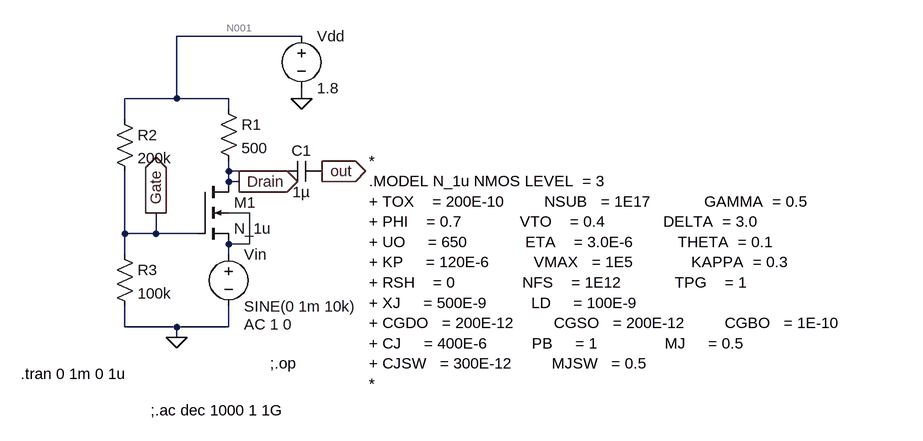
[diagram p0: schematic common gate exam.asc]
common gate exam.asc, the LTspice schematic file:
Version 4
SHEET 1 1292 680
WIRE 336 -128 144 -128
WIRE 144 -32 144 -128
WIRE 144 -32 64 -32
WIRE 224 -32 144 -32
WIRE 336 -32 336 -48
WIRE 224 -16 224 -32
WIRE 64 0 64 -32
WIRE 224 80 224 64
WIRE 304 80 224 80
WIRE 224 96 224 80
WIRE 240 96 224 96
WIRE 256 144 224 144
WIRE 64 176 64 80
WIRE 112 176 112 144
WIRE 112 176 64 176
WIRE 176 176 112 176
WIRE 256 192 256 144
WIRE 256 192 224 192
WIRE 64 208 64 176
WIRE 224 208 224 192
WIRE 64 320 64 288
WIRE 144 320 64 320
WIRE 224 320 224 288
WIRE 224 320 144 320
WIRE 144 336 144 320
FLAG 336 -32 0
FLAG 144 336 0
FLAG 368 80 out
IOPIN 368 80 Out
FLAG 112 144 Gate
IOPIN 112 144 Out
FLAG 240 96 Drain
IOPIN 240 96 Out
SYMBOL nmos4 176 96 R0
SYMATTR InstName M1
SYMATTR Value N_1u
SYMATTR Value2 l=1u w=416u
SYMBOL voltage 224 192 R0
WINDOW 123 24 124 Left 2
WINDOW 39 0 0 Left 0
SYMATTR Value2 AC 1 0
SYMATTR InstName Vin
SYMATTR Value SINE(0 1m 10k)
SYMBOL res 208 -32 R0
SYMATTR InstName R1
SYMATTR Value 500
SYMBOL voltage 336 -144 R0
WINDOW 123 0 0 Left 0
WINDOW 39 0 0 Left 0
SYMATTR InstName Vdd
SYMATTR Value 1.8
SYMBOL res 48 -16 R0
SYMATTR InstName R2
SYMATTR Value 200k
SYMBOL res 48 192 R0
SYMATTR InstName R3
SYMATTR Value 100k
SYMBOL cap 368 64 R90
WINDOW 0 0 32 VBottom 2
WINDOW 3 32 32 VTop 2
SYMATTR InstName C1
SYMATTR Value 1µ
TEXT 440 64 Left 2 !*                                                                   \n.MODEL N_1u NMOS LEVEL  = 3                  \n+ TOX    = 200E-10         NSUB   = 1E17            GAMMA  = 0.5          \n+ PHI    = 0.7             VTO    = 0.4             DELTA  = 3.0         \n+ UO     = 650             ETA    = 3.0E-6          THETA  = 0.1          \n+ KP     = 120E-6          VMAX   = 1E5             KAPPA  = 0.3                \n+ RSH    = 0               NFS    = 1E12            TPG    = 1                  \n+ XJ     = 500E-9          LD     = 100E-9                 \n+ CGDO   = 200E-12         CGSO   = 200E-12         CGBO   = 1E-10              \n+ CJ     = 400E-6          PB     = 1               MJ     = 0.5           \n+ CJSW   = 300E-12         MJSW   = 0.5                                  \n*
TEXT -96 392 Left 2 !.tran 0 1m 0 1u
TEXT 288 376 Left 2 !;.op
TEXT 104 448 Left 2 !;.ac dec 1000 1 1G

The netlist it stands for:
* common gate exam.asc
M1 Drain Gate N002 N002 N_1u l=1u w=416u
Vin N002 0 SINE(0 1m 10k) AC 1 0
R1 N001 Drain 500
Vdd N001 0 1.8
R2 N001 Gate 200k
R3 Gate 0 100k
C1 out Drain 1µ
.model NMOS NMOS
.model PMOS PMOS
.lib standard.mos
*
.MODEL N_1u NMOS LEVEL  = 3
+ TOX    = 200E-10         NSUB   = 1E17            GAMMA  = 0.5
+ PHI    = 0.7             VTO    = 0.4             DELTA  = 3.0
+ UO     = 650             ETA    = 3.0E-6          THETA  = 0.1
+ KP     = 120E-6          VMAX   = 1E5             KAPPA  = 0.3
+ RSH    = 0               NFS    = 1E12            TPG    = 1
+ XJ     = 500E-9          LD     = 100E-9
+ CGDO   = 200E-12         CGSO   = 200E-12         CGBO   = 1E-10
+ CJ     = 400E-6          PB     = 1               MJ     = 0.5
+ CJSW   = 300E-12         MJSW   = 0.5
*
.tran 0 1m 0 1u
;.op
;.ac dec 1000 1 1G
.backanno
.end

* Results of the author's LTspice run, read from the files saved beside the schematic
* Operating Point, zero values left out:
*   V(drain) = 1.019 V
*   V(gate) = 600 mV
*   V(n001) = 1.8 V
*   V(out) = 1.019 µV
*   Id(M1) = 1.562 mA
*   Ib(M1) = -1.029 pA
*   Is(M1) = -1.562 mA
*   I(R3) = 6 µA
*   I(R2) = 6 µA
*   I(R1) = 1.562 mA
*   I(Vdd) = -1.568 mA
*   I(Vin) = 1.562 mA
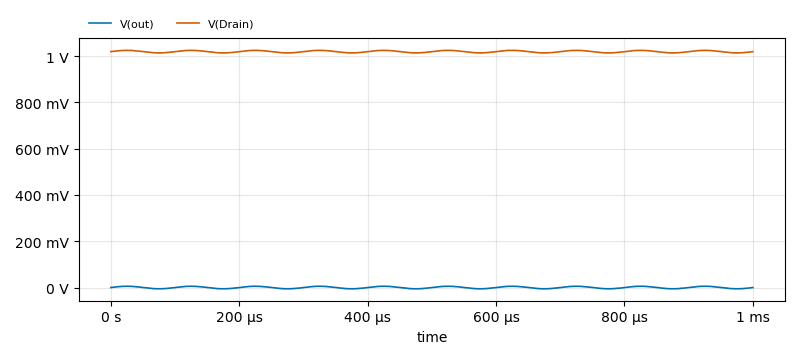
[diagram p1: Transient Analysis of common gate exam.asc, plotted from the saved traces]
* Transient Analysis, 1 run:
*   V(out): min -5.495 mV, max 5.492 mV, average 8.353 µV, rms 3.9 mV, last -7.945 µV
*   V(Drain): min 1.014 V, max 1.025 V, average 1.019 V, rms 1.019 V, last 1.019 V